# EAGLE design PNP - Tray_ICs (EAGLE 9.6.2)
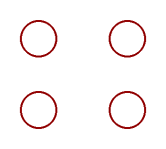
[diagram p0: schematic, sheet 1]

## Parts
U$1  FIDUCIAL  [FIDUCIAL_1MM]
U$2  FIDUCIAL  [FIDUCIAL_1MM]
U$3  FIDUCIAL  [FIDUCIAL_1MM]
U$4  FIDUCIAL  [FIDUCIAL_1MM]

## Library data of the parts
U$1-U$4 = adafruit:FIDUCIAL: For use by pick and place machines to calibrate the vision/machine, 1mm By microbuilder.eu

## Board
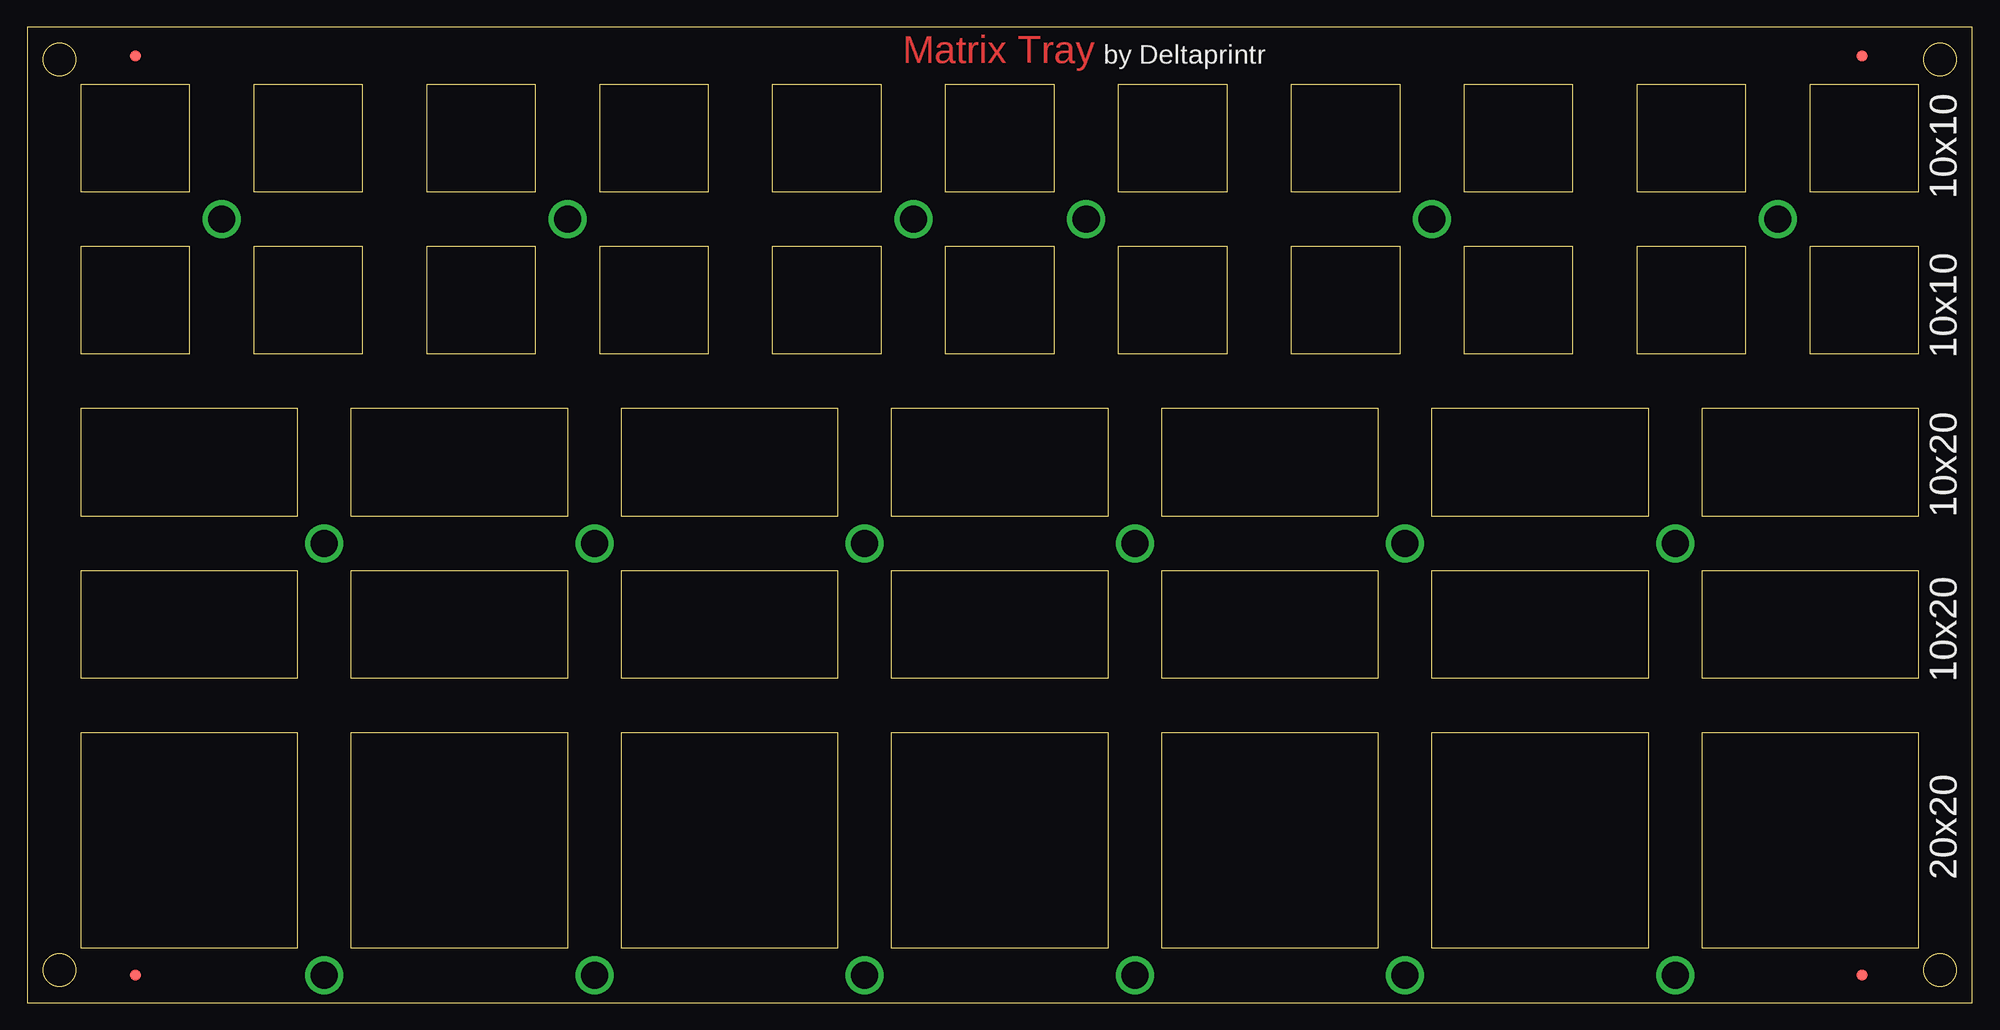
[diagram p1: board, top side]

Size 180 x 90.28 mm. Coordinates in mm from the lower left corner, seen from the top.
Outline: 85,60 85,70 95,70 95,60 85,60
Outline: 133,60 133,70 143,70 143,60 133,60
Outline: 5,30 5,40 25,40 25,30 5,30
Outline: 30,45 30,55 50,55 50,45 30,45
Outline: 105,30 105,40 125,40 125,30 105,30
Outline: 149,75 149,85 159,85 159,75 149,75
Outline: 165,60 165,70 175,70 175,60 165,60
Outline: 133,75 133,85 143,85 143,75 133,75
Outline: 5,75 5,85 15,85 15,75 5,75
Outline: 30,30 30,40 50,40 50,30 30,30
Outline: 53,60 53,70 63,70 63,60 53,60
Outline: 80,30 80,40 100,40 100,30 80,30
Outline: 5,25 25,25 25,5 5,5 5,25
Outline: 155,30 155,40 175,40 175,30 155,30
Outline: 69,60 69,70 79,70 79,60 69,60
Outline: 149,60 149,70 159,70 159,60 149,60
Outline: 165,75 165,85 175,85 175,75 165,75
Outline: 21,75 21,85 31,85 31,75 21,75
Outline: 130,25 150,25 150,5 130,5 130,25
Outline: 85,75 85,85 95,85 95,75 85,75
Outline: 37,60 37,70 47,70 47,60 37,60
Outline: 155,25 175,25 175,5 155,5 155,25
Outline: 69,75 69,85 79,85 79,75 69,75
Outline: 117,60 117,70 127,70 127,60 117,60
Outline: 53,75 53,85 63,85 63,75 53,75
Outline: 101,60 101,70 111,70 111,60 101,60
Outline: 105,25 125,25 125,5 105,5 105,25
Outline: 80,25 100,25 100,5 80,5 80,25
Outline: 37,75 37,85 47,85 47,75 37,75
Outline: 80,45 80,55 100,55 100,45 80,45
Outline: 55,45 55,55 75,55 75,45 55,45
Outline: 101,75 101,85 111,85 111,75 101,75
Outline: 117,75 117,85 127,85 127,75 117,75
Outline: 105,45 105,55 125,55 125,45 105,45
Outline: 30,25 50,25 50,5 30,5 30,25
Outline: 55,30 55,40 75,40 75,30 55,30
Outline: 5,45 5,55 25,55 25,45 5,45
Outline: 130,45 130,55 150,55 150,45 130,45
Outline: 21,60 21,70 31,70 31,60 21,60
Outline: 130,30 130,40 150,40 150,30 130,30
Outline: 155,45 155,55 175,55 175,45 155,45
Outline: 55,25 75,25 75,5 55,5 55,25
Outline: 5,60 5,70 15,70 15,60 5,60
Outline: 0,90.28 0,0 180,0 180,90.28 0,90.28
Outline: circle at 177,87.28 radius 1.5
Outline: circle at 3,87.28 radius 1.5
Outline: circle at 3,3 radius 1.5
Outline: circle at 177,3 radius 1.5
Copper layers (1*16): Top 0.035mm / dielectric 1.5mm / Bottom 0.035mm
Design rules "default": minimum track width 6mil, minimum drill 0.35mm, track to track 6mil, track to pad 6mil, pad to pad 6mil, via to via 6mil, smd to smd 6mil, copper to edge 40mil, drill to drill 6mil, minimum pad ring 10mil, minimum via ring 8mil, stop-mask expansion 4mil, vias tented up to drill 0mil, thermal gap 10mil

### Footprints (pad centres in the part's own frame; a part is rotated, then mirrored left to right if it is on the bottom)
FIDUCIAL_1MM = smd 1 x 1: 1 0,0

### Placement (x,y rotation side)
U$1  169.8,2.54 0 top
U$2  10.03,2.54 0 top
U$3  169.8,87.59 0 top
U$4  10.03,87.59 0 top

### Tracks (layer width: path | path; a pad name or v marks a point on that pad's centre or on a via)
N$1  (via drill 2.5)
  other vias: 18,72.5
N$2  (via drill 2.5)
  other vias: 50,72.5
N$3  (via drill 2.5)
  other vias: 82,72.5
N$4  (via drill 2.5)
  other vias: 98,72.5
N$5  (via drill 2.5)
  other vias: 130,72.5
N$6  (via drill 2.5)
  other vias: 162,72.5
N$7  (via drill 2.5)
  other vias: 27.5,42.5
N$8  (via drill 2.5)
  other vias: 52.5,42.5
N$9  (via drill 2.5)
  other vias: 77.5,42.5
N$10  (via drill 2.5)
  other vias: 102.5,42.5
N$11  (via drill 2.5)
  other vias: 127.5,42.5
N$12  (via drill 2.5)
  other vias: 152.5,42.5
N$13  (via drill 2.5)
  other vias: 152.5,2.5
N$14  (via drill 2.5)
  other vias: 127.5,2.5
N$15  (via drill 2.5)
  other vias: 102.5,2.5
N$16  (via drill 2.5)
  other vias: 77.5,2.5
N$17  (via drill 2.5)
  other vias: 52.5,2.5
N$18  (via drill 2.5)
  other vias: 27.5,2.5

### Text on the board
Top: Matrix Tray
tPlace: by Deltaprintr | 10x10 | 10x10 | 10x20 | 10x20 | 20x20
tStop: Matrix Tray